# EAGLE design aedr_breakout (EAGLE 6.1)
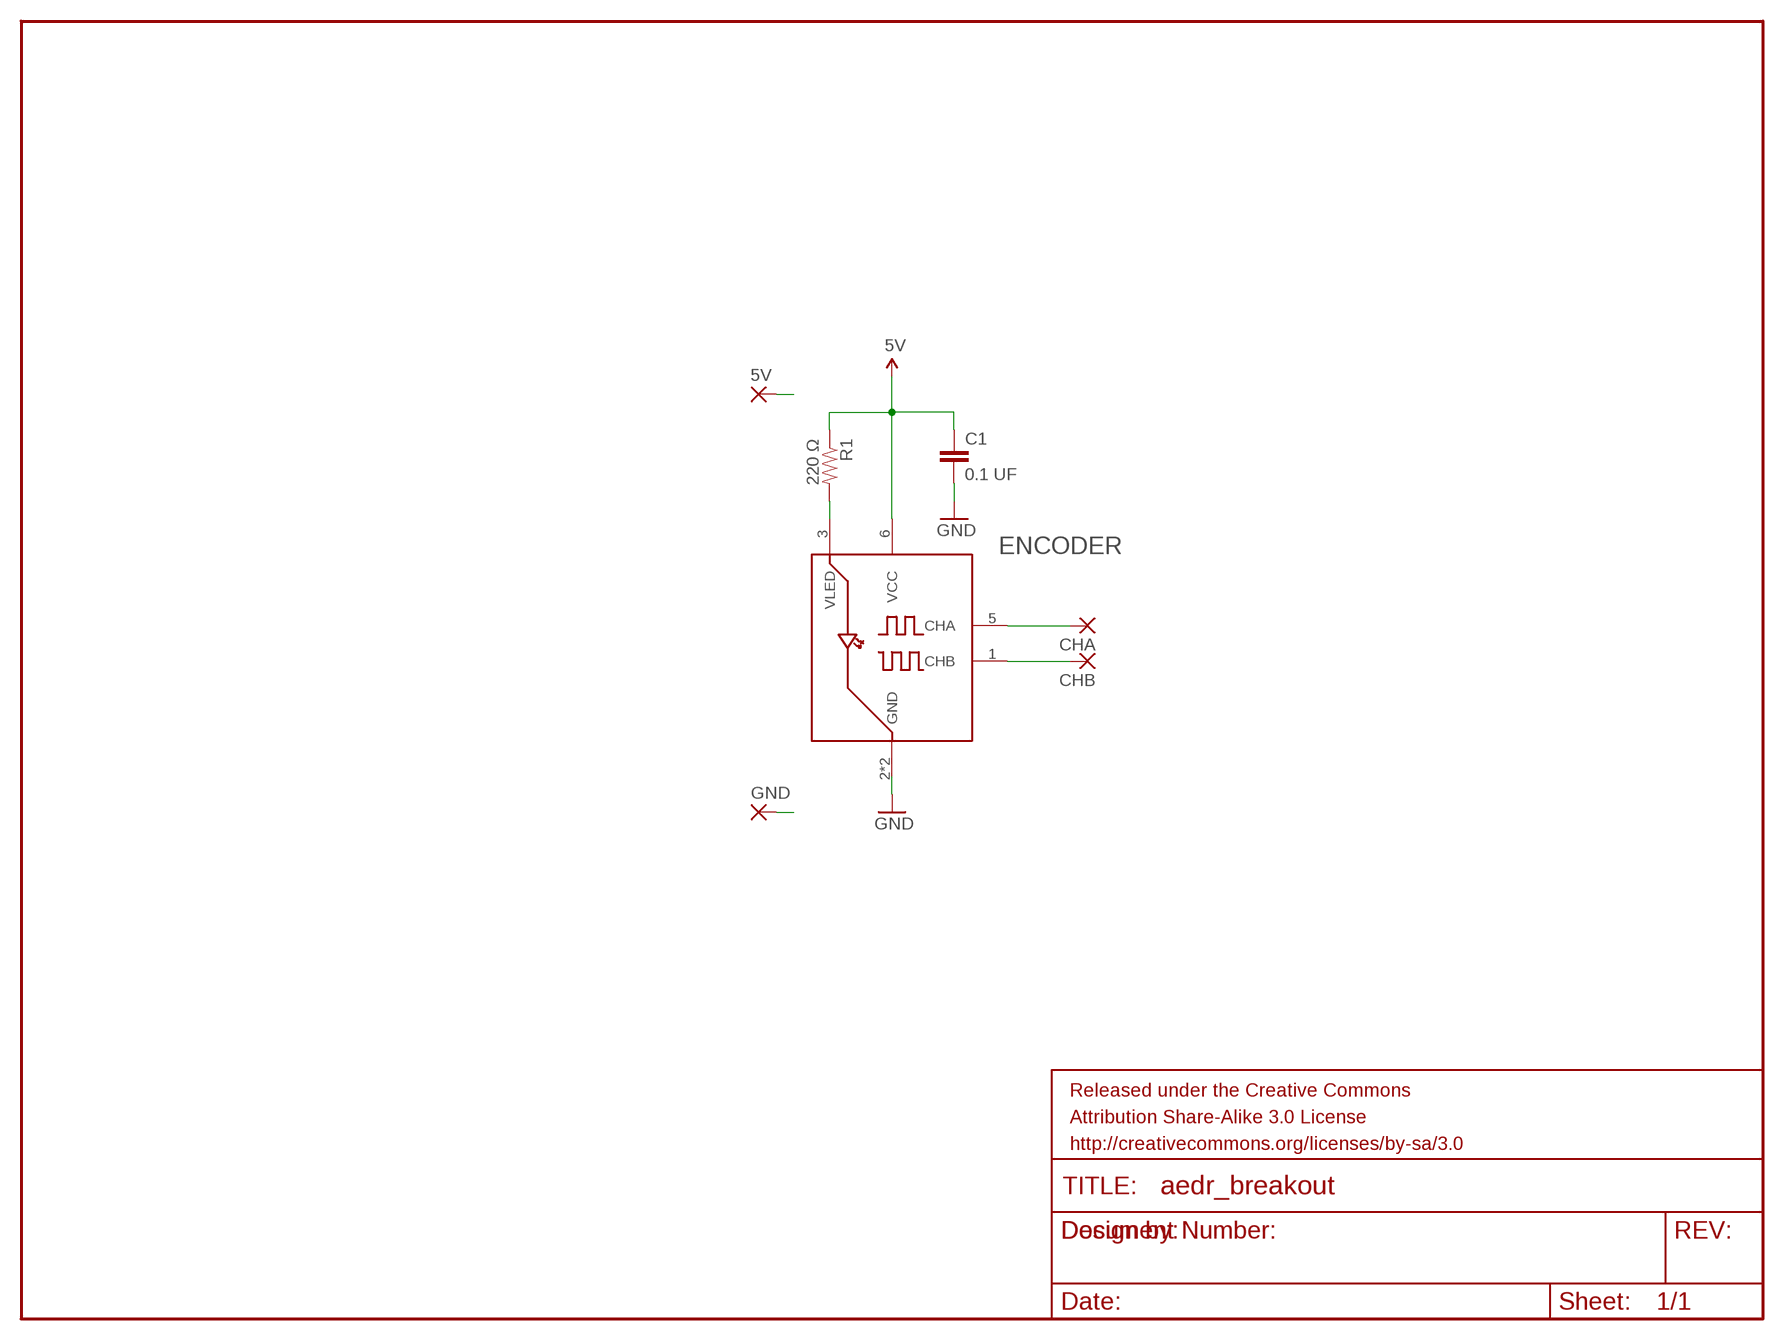
[diagram p0: schematic, sheet 1]

## Parts
5V  WIREPADSMD1,27-254  [SMD1,27-2,54]
C1  0.1 UF  CAP0402-CAP  [0402-CAP]
CHA  WIREPADSMD1,27-254  [SMD1,27-2,54]
CHB  WIREPADSMD1,27-254  [SMD1,27-2,54]
ENCODER  AEDR-8300-K  [AEDR-8300]
GND  WIREPADSMD1,27-254  [SMD1,27-2,54]
R1  220 Ω  RESISTOR0402-RES  [0402-RES]

## Nets
5V: 5V.1(P) C1.1 ENCODER.6(VCC) R1.1
CHA: CHA.1(P) ENCODER.5(CHA)
CHB: CHB.1(P) ENCODER.1(CHB)
GND: C1.2 ENCODER.2(GND) ENCODER.4(GND)
N$1: GND.1(P)
N$2: ENCODER.3(VLED) R1.2

## Library data of the parts
5V CHA CHB GND = wirepad:WIREPAD: Wire PAD connect wire on PCB
C1 = SparkFun-Passives:CAP: Capacitor Standard 0603 ceramic capacitor, and 0.1" leaded capacitor.
ENCODER = ee192team10:AEDR-8300-K
R1 = SparkFun-Passives:RESISTOR: Resistor Basic schematic elements and footprints for 0603, 1206, and PTH resistors.

## Board
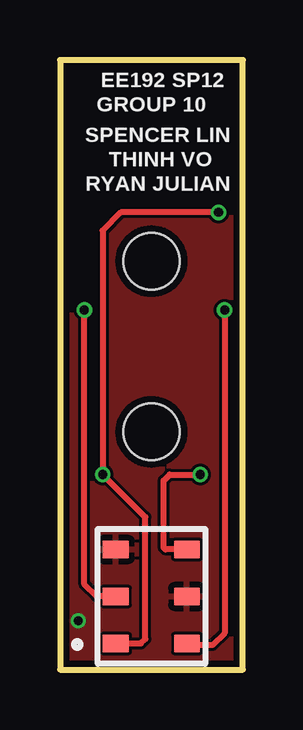
[diagram p1: board, top side]
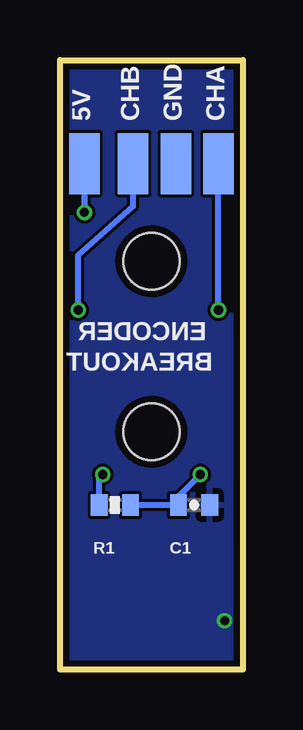
[diagram p2: board, bottom side, seen from below]

Size 7.62 x 25.4 mm. Coordinates in mm from the lower left corner, seen from the top.
Outline: 0,0 7.62,0 7.62,25.4 0,25.4 0,0
Copper layers (1*16): Top 2mil / dielectric 27mil / Bottom 2mil
Design rules: minimum track width 5mil, minimum drill 10mil, track to track 5mil, track to pad 5mil, pad to pad 5mil, via to via 5mil, smd to smd 5mil, copper to edge 10mil, drill to drill 10mil, minimum pad ring 7mil, minimum via ring 5mil, stop-mask expansion 2mil, vias tented up to drill 0mil, thermal gap 10mil

### Footprints (pad centres in the part's own frame; a part is rotated, then mirrored left to right if it is on the bottom)
SMD1,27-2,54 = smd 1.27 x 2.54: 1 0,0
0402-CAP = smd 0.7 x 0.9: 1 -0.65,0; 2 0.65,0
AEDR-8300 = smd 1.08 x 0.72: 1 -1.48,1.96; 2 -1.48,0; 3 -1.48,-1.96; 4 1.48,-1.96; 5 1.48,0; 6 1.48,1.96
0402-RES = smd 0.7 x 0.9: 1 -0.65,0; 2 0.65,0
HOLE-2-56 = hole 2.349: 0,0

### Placement (x,y rotation side)
5V  6.6,21.08 180 bottom
C1  2.03,6.86 0 bottom
CHA  1.02,21.08 180 bottom
CHB  4.57,21.08 0 bottom
ENCODER  3.81,3.05 180 top
GND  2.79,21.08 180 bottom
R1  5.33,6.86 180 bottom
U$1  [HOLE-2-56]  3.81,9.91 0 top
U$4  [HOLE-2-56]  3.81,17.02 0 top

### Tracks (layer width: path | path; a pad name or v marks a point on that pad's centre or on a via)
5V  (via drill 0.38)
  Top 0.254: v6.6,19.05 2.54,19.05 1.78,18.29 v1.78,8.13 3.56,6.35 3.56,1.27 3.37,1.09 ENCODER.6
  Bottom 0.254: R1.1 C1.1 2.68,7.22 v1.78,8.13 | 5V.1 v6.6,19.05
CHA  (via drill 0.38)
  Top 0.254: ENCODER.5 1.52,3.05 1.02,3.56 v1.02,14.99
  Bottom 0.254: v1.02,14.99 CHA.1
CHB  (via drill 0.38)
  Top 0.254: v6.86,14.99 6.86,1.52 6.35,1.02 5.36,1.02 ENCODER.1
  Bottom 0.254: v6.86,14.99 6.86,17.27 4.57,19.3 CHB.1
GND  (via drill 0.38)
  other vias: 0.76,2.03
  pour Top: 0,25.4 7.62,25.4 7.62,0 0,0
  pour Bottom: 0,25.4 0,0 7.62,0 7.62,25.4
N$2  (via drill 0.38)
  Top 0.254: ENCODER.3 4.39,5.01 4.32,5.08 4.32,7.87 4.57,8.13 v5.84,8.13
  Bottom 0.254: R1.2 5.98,7.99 v5.84,8.13

### Text on the board
tPlace: EE192 SP12 | GROUP 10 | SPENCER LIN | THINH VO | RYAN JULIAN
bPlace: ENCODER | BREAKOUT